# Altium project Urukul.PrjPCB (part 5 of 5)

## Sheet CLK_INPUT.SchDoc: Clock distribution
size 420 x 297 mm; Author: G.K.; CompanyName: WUT; DrawnBy: G.K.; Organization: WUT ISE; Address1: Warsaw Univeristy of Technology; Address2: Nowowiejska 15/19; DocumentNumber: 6; Revision: 1.5.6; SheetNumber: 6; SheetTotal: 7; EDA_Number: ARTIQ; Projet: ARTIQ/SINARA; ModifiedBy: -; CreateDate: XX/XX/XXXX; CheckedDate: -; Title2: and generation; DivGrp: ISE; Designer: G.K.; ModifiedDate: -; ProjectName: ARTIQ/SINARA
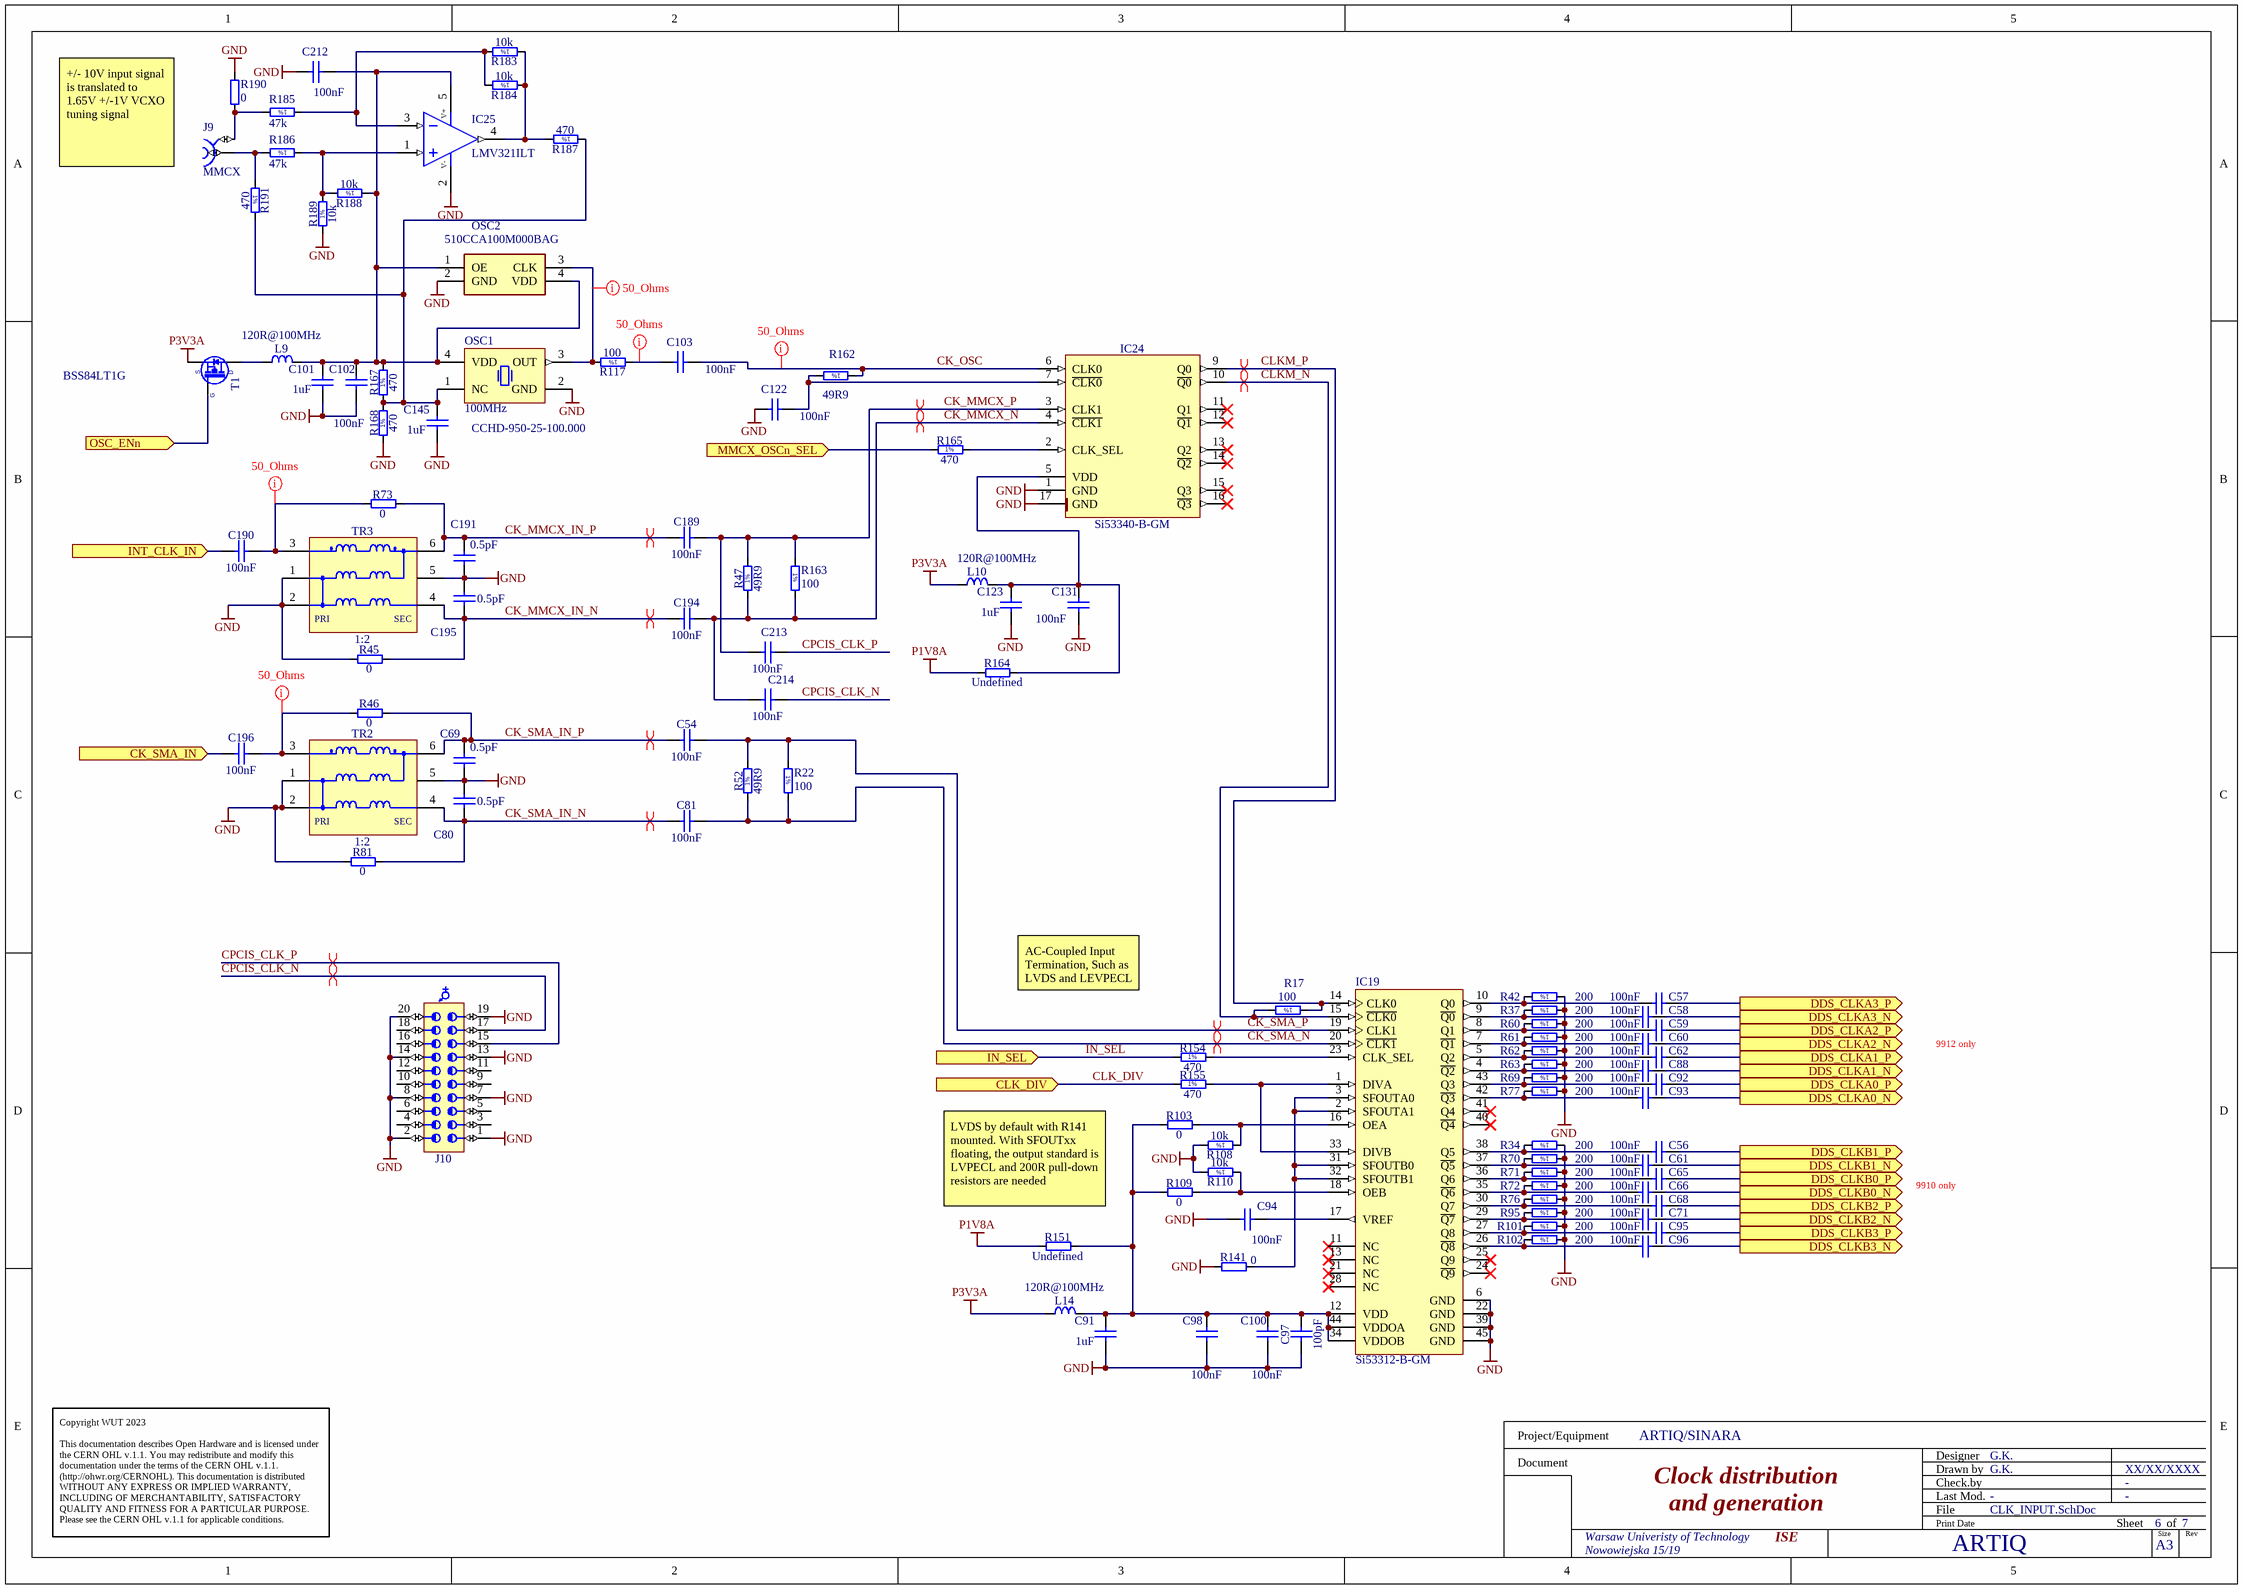
[diagram p6: CLK_INPUT.SchDoc]

### Parts
C54  100nF  [CAPC1005X55N]
C56  100nF  [CAPC1005X55N]
C57  100nF  [CAPC1005X55N]
C58  100nF  [CAPC1005X55N]
C59  100nF  [CAPC1005X55N]
C60  100nF  [CAPC1005X55N]
C61  100nF  [CAPC1005X55N]
C62  100nF  [CAPC1005X55N]
C65  100nF  [CAPC1005X55N]
C66  100nF  [CAPC1005X55N]
C68  100nF  [CAPC1005X55N]
C69  0.5pF  [CAPC1005X50N]
C71  100nF  [CAPC1005X55N]
C80  0.5pF  [CAPC1005X50N]
C81  100nF  [CAPC1005X55N]
C88  100nF  [CAPC1005X55N]
C91  1uF  [CAPC1005X55N]
C92  100nF  [CAPC1005X55N]
C93  100nF  [CAPC1005X55N]
C94  100nF  [CAPC1005X55N]
C95  100nF  [CAPC1005X55N]
C96  100nF  [CAPC1005X55N]
C97  100pF  [CAPC1005X55N]
C98  100nF  [CAPC1005X55N]
C100  100nF  [CAPC1005X55N]
C101  1uF  [CAPC1005X55N]
C102  100nF  [CAPC1005X55N]
C103  100nF  [CAPC1005X55N]
C122  100nF  [CAPC1005X55N]
C123  1uF  [CAPC1005X55N]
C131  100nF  [CAPC1005X55N]
C145  1uF  [CAPC1005X55N]
C189  100nF  [CAPC1005X55N]
C190  100nF  [CAPC1005X55N]
C191  0.5pF  [CAPC1005X50N]
C194  100nF  [CAPC1005X55N]
C195  0.5pF  [CAPC1005X50N]
C196  100nF  [CAPC1005X55N]
C212  100nF  [CAPC1005X55N]
C213  100nF  [CAPC1005X55N]
C214  100nF  [CAPC1005X55N]
IC19  Si53312-B-GM  [SLAB-QFN-44-2800x2800TP_N]
IC24  Si53340-B-GM  [QFN50P300X300X90-17N-S175]
IC25  LMV321ILT  [SOT95P280X145-5N]
J9  MMCX  [SAMTEC_MMCX-J-P-H-ST-TH1]
J10  (no value)  [SAMTEC_LSS-110-01-L-DV-A]
L9  120R@100MHz  [INDC1608X95N]
L10  120R@100MHz  [INDC1608X95N]
L14  120R@100MHz  [INDC1608X95N]
OSC1  100MHz  Manufacturer Part Number: CCHD-950-25-100.000  [OSC_CRYSTEK_CCHD-950]
OSC2  510CCA100M000BAG  [510CBA49M1520BAG]
R17  100  [RESC1005X40N]
R22  100  [RESC1005X40N]
R34  200  [RESC1005X40N]
R37  200  [RESC1005X40N]
R42  200  [RESC1005X40N]
R45  0  [RESC1005X40N]
R46  0  [RESC1005X40N]
R47  49R9  [RESC1005X40N]
R52  49R9  [RESC1005X40N]
R60  200  [RESC1005X40N]
R61  200  [RESC1005X40N]
R62  200  [RESC1005X40N]
R63  200  [RESC1005X40N]
R69  200  [RESC1005X40N]
R70  200  [RESC1005X40N]
R71  200  [RESC1005X40N]
R72  200  [RESC1005X40N]
R73  0  [RESC1005X40N]
R76  200  [RESC1005X40N]
R77  200  [RESC1005X40N]
R81  0  [RESC1005X40N]
R95  200  [RESC1005X40N]
R101  200  [RESC1005X40N]
R102  200  [RESC1005X40N]
R103  0  [RESC1608X55N]
R108  10k  [RESC1005X40N]
R109  0  [RESC1608X55N]
R110  10k  [RESC1005X40N]
R117  100  [RESC1005X40N]
R141  0  [RESC1608X55N]
R151  Undefined  [RESC1608X55N]
R154  470  [RESC1005X40N]
R155  470  [RESC1005X40N]
R162  49R9  [RESC1005X40N]
R163  100  [RESC1005X40N]
R164  Undefined  [RESC1608X55N]
R165  470  [RESC1005X40N]
R167  470  [RESC1005X40N]
R168  470  [RESC1005X40N]
R183  10k  [RESC1005X40N]
R184  10k  [RESC1005X40N]
R185  47k  [RESC1608X55N]
R186  47k  [RESC1608X55N]
R187  470  [RESC1005X40N]
R188  10k  [RESC1005X40N]
R189  10k  [RESC1005X40N]
R190  0  [RESC1005X40N]
R191  470  [RESC1005X40N]
T1  BSS84LT1G  [SOT95P240X110-3N]
TR2  1:2  [XFMR_MINI-CIRCUITS_DB1627]
TR3  1:2  [XFMR_MINI-CIRCUITS_DB1627]

### Ports
CK_SMA_IN (in), CLK_DIV (in), DDS_CLKA0_N (out), DDS_CLKA0_P (out), DDS_CLKA1_N (out), DDS_CLKA1_P (out), DDS_CLKA2_N (out), DDS_CLKA2_P (out), DDS_CLKA3_N (out), DDS_CLKA3_P (out), DDS_CLKB0_N (out), DDS_CLKB0_P (out), DDS_CLKB1_N (out), DDS_CLKB1_P (out), DDS_CLKB2_N (out), DDS_CLKB2_P (out), DDS_CLKB3_N (out), DDS_CLKB3_P (out), IN_SEL (in), INT_CLK_IN (in), MMCX_OSCn_SEL (in), OSC_ENn (in)

### Nets
GND: C69.1 C80.2 C91.1 C94.1 C97.1 C98.1 C100.1 C101.1 C102.1 C122.2 C123.1 C131.1 C145.1 C191.1 C195.2 C212.2 IC19.6(GND) IC19.22(GND) IC19.39(GND) IC19.45(GND) IC24.1(GND) IC24.17(GND) IC25.2(V-) J10.1 J10.2 J10.7 J10.8 J10.13 J10.14 J10.19 J10.20 OSC1.2(GND) OSC2.2(GND) R34.1 R37.1 R42.1 R45.1 R60.1 R61.1 R62.1 R63.1 R69.1 R70.1 R71.1 R72.1 R76.1 R77.1 R81.1 R95.1 R101.1 R102.1 R108.2 R110.2 R141.1 R168.1 R189.1 R190.2 TR2.1(P1) TR2.2(P1) TR2.5(NC) TR3.1(P1) TR3.2(P1) TR3.5(NC)
P1V8A: R151.1 R164.1
P3V3A: L10.2 L14.2 T1.2(S)
CK_MMCX_IN_N: C194.1 C195.1 R45.2 TR3.4(S1)
CK_MMCX_IN_P: C189.1 C191.2 R73.2 TR3.6(S1)
CK_MMCX_N: C194.2 C214.1 IC24.4(~{CLK1}) R47.1 R163.2
CK_MMCX_P: C189.2 C213.1 IC24.3(CLK1) R47.2 R163.1
CK_OSC: C103.1 IC24.6(CLK0) R162.1
CK_SMA_IN: C196.1 ; port CK_SMA_IN
CK_SMA_IN_N: C80.1 C81.1 R81.2 TR2.4(S1)
CK_SMA_IN_P: C54.1 C69.2 R46.2 TR2.6(S1)
CK_SMA_N: C81.2 IC19.20(~{CLK1}) R22.2 R52.1
CK_SMA_P: C54.2 IC19.19(CLK1) R22.1 R52.2
CLK_DIV: R155.1 ; port CLK_DIV
CLKM_N: IC19.15(~{CLK0}) IC24.10(~{Q0}) R17.2
CLKM_P: IC19.14(CLK0) IC24.9(Q0) R17.1
CPCIS_CLK_N: C214.2 J10.17
CPCIS_CLK_P: C213.2 J10.15
DDS_CLK_N: C93.1 ; port DDS_CLKA0_N
DDS_CLK_N: C88.1 ; port DDS_CLKA1_N  [a separate net that carries the same name]
DDS_CLK_N: C60.1 ; port DDS_CLKA2_N  [a separate net that carries the same name]
DDS_CLK_N: C58.1 ; port DDS_CLKA3_N  [a separate net that carries the same name]
DDS_CLK_P: C92.1 ; port DDS_CLKA0_P
DDS_CLK_P: C62.1 ; port DDS_CLKA1_P  [a separate net that carries the same name]
DDS_CLK_P: C59.1 ; port DDS_CLKA2_P  [a separate net that carries the same name]
DDS_CLK_P: C57.1 ; port DDS_CLKA3_P  [a separate net that carries the same name]
DDS_CLKB0_N: C66.1 ; port DDS_CLKB0_N
DDS_CLKB0_P: C65.1 ; port DDS_CLKB0_P
DDS_CLKB1_N: C61.1 ; port DDS_CLKB1_N
DDS_CLKB1_P: C56.1 ; port DDS_CLKB1_P
DDS_CLKB2_N: C71.1 ; port DDS_CLKB2_N
DDS_CLKB2_P: C68.1 ; port DDS_CLKB2_P
DDS_CLKB3_N: C96.1 ; port DDS_CLKB3_N
DDS_CLKB3_P: C95.1 ; port DDS_CLKB3_P
IN_SEL: R154.1 ; port IN_SEL
INT_CLK_IN: C190.1 ; port INT_CLK_IN
MMCX_OSCn_SEL: R165.1 ; port MMCX_OSCn_SEL
OSC_ENn: T1.1(G) ; port OSC_ENn
NetC56_2: C56.2 IC19.38(Q5) R34.2
NetC57_2: C57.2 IC19.10(Q0) R42.2
NetC58_2: C58.2 IC19.9(~{Q0}) R37.2
NetC59_2: C59.2 IC19.8(Q1) R60.2
NetC60_2: C60.2 IC19.7(~{Q1}) R61.2
NetC61_2: C61.2 IC19.37(~{Q5}) R70.2
NetC62_2: C62.2 IC19.5(Q2) R62.2
NetC65_2: C65.2 IC19.36(Q6) R71.2
NetC66_2: C66.2 IC19.35(~{Q6}) R72.2
NetC68_2: C68.2 IC19.30(Q7) R76.2
NetC71_2: C71.2 IC19.29(~{Q7}) R95.2
NetC88_2: C88.2 IC19.4(~{Q2}) R63.2
NetC91_2: C91.2 C97.2 C98.2 C100.2 IC19.12(VDD) IC19.34(VDDOB) IC19.44(VDDOA) L14.1 R103.1 R109.1 R151.2
NetC92_2: C92.2 IC19.43(Q3) R69.2
NetC93_2: C93.2 IC19.42(~{Q3}) R77.2
NetC94_2: C94.2 IC19.17(VREF)
NetC95_2: C95.2 IC19.27(Q8) R101.2
NetC96_2: C96.2 IC19.26(~{Q8}) R102.2
NetC101_2: C101.2 C102.2 C212.1 IC25.5(V+) L9.1 OSC1.4(VDD) OSC2.1(OE) OSC2.4(VDD) R167.2 R188.1
NetC103_2: C103.2 R117.1
NetC122_1: C122.1 IC24.7(~{CLK0}) R162.2
NetC123_2: C123.2 C131.2 IC24.5(VDD) L10.1 R164.2
NetC145_2: C145.2 OSC1.1(NC) R167.1 R168.2 R187.1 R191.2
NetC190_2: C190.2 R73.1 TR3.3(P1)
NetC196_2: C196.2 R46.1 TR2.3(P1)
NetIC19_1: IC19.1(DIVA) IC19.33(DIVB) R155.2
NetIC19_2: IC19.2(SFOUTA1) IC19.3(SFOUTA0) IC19.31(SFOUTB0) IC19.32(SFOUTB1) R141.2
NetIC19_16: IC19.16(OEA) R103.2 R108.1
NetIC19_18: IC19.18(OEB) R109.2 R110.1
NetIC19_23: IC19.23(CLK_SEL) R154.2
NetIC24_2: IC24.2(CLK_SEL) R165.2
NetIC25_1: IC25.1(IN+) R186.1 R188.2 R189.2
NetIC25_3: IC25.3(IN-) R183.2 R184.2 R185.1
NetIC25_4: IC25.4(OUT) R183.1 R184.1 R187.2
NetJ9_1: J9.1 R186.2 R191.1
NetJ9_2: J9.2 R185.2 R190.1
NetL9_2: L9.2 T1.3(D)
NetOSC1_3: OSC1.3(OUT) OSC2.3(CLK) R117.2

Not connected (* = marked no-connect by the designer): IC19 11(NC)* 13(NC)* 21(NC)* 24(~{Q9})* 25(Q9)* 28(NC)* 40(~{Q4})* 41(Q4)*; IC24 11(Q1)* 12(~{Q1})* 13(Q2)* 14(~{Q2})* 15(Q3)* 16(~{Q3})*; J10 3 4 5 6 9 10 11 12 16 18

### Layout directives
differential pair: CK_MMCX_IN_N, CK_MMCX_IN_P, CK_MMCX_N, CK_MMCX_P, CK_SMA_IN_N, CK_SMA_IN_P, CK_SMA_N, CK_SMA_P, CLKM_N, CLKM_P, CPCIS_CLK_N, CPCIS_CLK_P
net class 50_Ohms: CK_OSC, NetC103_2, NetC190_2, NetC196_2, NetOSC1_3

### Notes on the sheet
- (near J9) +/- 10V input signal is translated to 1.65V +/-1V VCXO tuning signal
- AC-Coupled Input Termination, Such as LVDS and LEVPECL
- 9912 only
- LVDS by default with R141 mounted. With SFOUTxx floating, the output standard is LVPECL and 200R pull-down resistors are needed
- 9910 only
- Copyright WUT 2023
  This documentation describes Open Hardware and is licensed under the CERN OHL v.1.1. You may redistribute and modify this documentation under the terms of the CERN OHL v.1.1. (http://ohwr.org/CERNOHL). This documentation is distributed WITHOUT ANY EXPRESS OR IMPLIED WARRANTY, INCLUDING OF MERCHANTABILITY, SATISFACTORY QUALITY AND FITNESS FOR A PARTICULAR PURPOSE. Please see the CERN OHL v.1.1 for applicable conditions.
- Project/Equipment
- Document
- Designer
- Drawn by
- Check.by
- File
- Last Mod.
- Print Date
- Sheet
- Size
- A3
- of
- Rev
- (in symbol R0402_10K_1%_0.0625W_100PPM) 1%
- (in symbol R0402_49R9_1%_0.0625W_100PPM) 1%
- (in symbol R0402_100R_1%_0.0625W_100PPM) 1%
- (in symbol R0402_200R_1%_0.0625W_100PPM) 1%
- (in symbol R0402_470R_1%_0.0625W_100PPM) 1%
- (in symbol R0603_47K_1%_0.1W_100PPM) 1%
- (in symbol XFMR_MINI-CIRCUITS_TCM2-43X+) PRI; SEC

### Library data of the parts
C54 C56-C62 C65 C66 C68 C71 C81 C88 C92-C96 C98 C100 C102 C103 C122 C131 C189 C190 C194 C196 C212-C214 = CC0402_100NF_16V_10%_X5R: Non-polarised capacitor; Part Description: SMD Multilayer Chip Ceramic Capacitor; Manufacturer: GENERIC; Manufacturer1 Part Number: GRM155R61C104KA88D; Voltage: 16V; TC: X5R; Tolerance: ±10%; Part Number: CC0402_100NF_16V_10%_X5R; Component Kind: Standard; Component Type: Standard; Pin Count: 2; Value: 100nF; Status: None; Manufacturer Part Number: CC0402_100NF_16V_10%_X5R; Case: 0402; Mounted: Yes; Socket: No; SMD: Yes; Sense: No; Manufacturer1 Example: MURATA; Manufacturer1 ComponentHeight: 0.55mm; HelpURL: \\cern.ch\dfs\Applications\Altium\Datasheets\CC0402_X5R_MURATA_GRM.pdf; Author: CERN DEM JLC; CreateDate: 10.12.2013; LatestRevisionDate: 10.12.2013
C69 C80 C191 C195 = CC0402_0.5PF_25V_0.05PF_AVX_04023J0R5ABSTR: Non-polarised capacitor; Part Description: Thin-Film Chip Capacitors for RF Signal and Power Applications, Accu-P Series; Manufacturer: AVX; Voltage: 25V; Tolerance: ±0.05pF; Part Number: CC0402_0.5PF_25V_0.05PF_AVX_04023J0R5ABSTR; Component Kind: Standard; Component Type: Standard; Pin Count: 2; Value: 0.5pF; Status: None; Manufacturer Part Number: 04023J0R5ABSTR; Case: 0402; Mounted: Yes; Socket: No; SMD: Yes; Sense: No; ComponentHeight: 0.5mm; HelpURL: \\cern.ch\dfs\Applications\Altium\Datasheets\CC0402_AVX_ACCU-P.pdf; Author: CERN DEM JLC; CreateDate: 2017-02-22; LatestRevisionDate: 2017-02-22
C91 C101 C123 C145 = CC0402_1UF_16V_10%_X5R: Non-polarised capacitor; Part Description: SMD Multilayer Chip Ceramic Capacitor; Manufacturer: GENERIC; Manufacturer1 Part Number: C1005X5R1C105KT; Voltage: 16V; TC: X5R; Tolerance: ±10%; Part Number: CC0402_1UF_16V_10%_X5R; Component Kind: Standard; Component Type: Standard; Pin Count: 2; Value: 1uF; Status: Preferred; Manufacturer Part Number: CC0402_1UF_16V_10%_X5R; Case: 0402; Mounted: Yes; Socket: No; SMD: Yes; Sense: No; Manufacturer1 Example: TDK; Manufacturer1 ComponentHeight: 0.55mm; HelpURL: \\cern.ch\dfs\Applications\Altium\Datasheets\CC0402_X5R_TDK_C.pdf; Author: CERN DEM JLC; CreateDate: 2012-10-25; LatestRevisionDate: 2012-10-25
C97 = CC0402_100PF_50V_5%_C0G: Non-polarised capacitor; Part Description: SMD Multilayer Chip Ceramic Capacitor; Manufacturer: GENERIC; Manufacturer1 Part Number: C0402C101J5GACTU; Voltage: 50V; TC: C0G/NP0; Tolerance: ±5%; Part Number: CC0402_100PF_50V_5%_C0G; Component Kind: Standard; Component Type: Standard; Pin Count: 2; Value: 100pF; Status: Preferred; Manufacturer Part Number: CC0402_100PF_50V_5%_C0G; Case: 0402; Mounted: Yes; Socket: No; SMD: Yes; Sense: No; Manufacturer1 Example: KEMET; Manufacturer1 ComponentHeight: 0.55mm; HelpURL: \\cern.ch\dfs\Applications\Altium\Datasheets\CC0805_C0G_KEMET_(Commercial Grade).pdf; Author: CERN DEM JLC; CreateDate: 03.12.2007; LatestRevisionDate: 22.04.2015
IC19 = CMP-0510-00356-1: 1:10 Low Jitter Universal Buffer / Level Translator with 2:1 Input Mux, 1 to 1250 MHz, -40 to 85 degC, 44-pin QFN; Manufacturer: Silicon Labs; Output Format: LVPECL; LVDS; CML; HCSL; LVCMOS; Sub-Family: Clock Buffers; PartNumber: Si53312-B-GM; ComponentLink2URL: http://www.silabs.com/Support%20Documents/TechnicalDocs/Si53312.pdf; ComponentLink1URL: http://www.silabs.com/; ComponentLink3URL: http://www.silabs.com/Support%20Documents/TechnicalDocs/Si53302.pdf; ComponentLink1Description: Manufacturer URL; Code_IPC: J-STD-020; Frequency (MHz): 1 to 1250; ComponentLink2Description: Datasheet; ComponentLink3Description: Package Specification; Code_JEDEC: MO-220; Mounting Technology: Surface Mount; PackageDescription: 44-Pin Quad-Flat No-Leads Package, Body 7 x 7 mm, Pitch 0.5 mm; DatasheetVersion: Rev. 0.4; PackageReference: QFN-44
IC24 = Si53340-B-GM: Low-Jitter LVDS Fanout Clock Buffers, 10-Output,  Any-Input, Any-Frequency up to 1250MHz; Manufacturer: SILICON LABS; PressFit: No; Bonding: No; Part Number: Si53340-B-GM; Component Kind: Standard; Component Type: Standard; Device: Si53340-B-GM; PackageDescription: QFN, 0.50mm Pitch, Square; 16 Pin, 3.00mm L X 3.00mm W X 0.90mm H Body (w/thermal tab 1.75mm x 1.75mm), IPC Medium Density; Part Description: Low-Jitter LVDS Fanout Clock Buffers, 10-Output,  Any-Input, Any-Frequency up to 1250MHz; Manufacturer Part Number: Si53340-B-GM; Pin Count: 17; Case: QFN16; Mounted: Yes; Socket: No; SMD: Yes; Sense: No; ComponentHeight: 0.9mm; HelpURL: \\cern.ch\dfs\Applications\Altium\Datasheets\Si53340-B-GM.pdf; Author: CERN DEM MR; CreateDate: 04.09.2017; LatestRevisionDate: 04.09.2017
IC25 = LMV321ILT: Operational Amplifier; Part Description: Low Cost, Low Power, Input/Output Rail-To-Rail Operational Amplifiers; Manufacturer: ST MICROELECTRONICS; PressFit: No; Bonding: No; Part Number: LMV321ILT; Component Kind: Standard; Component Type: Standard; Device: LMV321ILT; PackageDescription: SOT, 0.95mm pitch; 5 pin, 1.60mm W X 2.90mm L X 1.45mm H body, IPC Medium Density; Manufacturer Part Number: LMV321ILT; Pin Count: 5; Case: SOT23-5; Mounted: Yes; Socket: No; SMD: Yes; Sense: No; ComponentHeight: 1.45mm; Author: CERN DEM MR; HelpURL: \\cern.ch\dfs\Applications\Altium\Datasheets\LMV321ILT.pdf; CreateDate: 02/10/2017; LatestRevisionDate: 02/10/2017
J9 = SAMTEC_MMCX-J-P-H-ST-TH1: Part Description: Straight Through-hole 50 Ohm Micro Mini RF Jack, MMCX Series; Manufacturer: SAMTEC; PressFit: No; Part Number: SAMTEC_MMCX-J-P-H-ST-TH1; Component Kind: Standard; Component Type: Standard; Pin Count: 2; Mounted: Yes; Socket: No; Sense: No; SMD: No; Status: None; Manufacturer Part Number: MMCX-J-P-H-ST-TH1; ComponentHeight: 4.35mm; HelpURL: \\cern.ch\dfs\Applications\Altium\Datasheets\SAMTEC_MMCX-J-P-H-ST-TH1.pdf; Author: CERN DEM JLC; CreateDate: 05.12.2012; LatestRevisionDate: 05.12.2012
J10 = SAMTEC_LSS-110-01-L-DV-A: Connector 20 Hermaphroditic; Part Description: 20 Contacts, Pitch 0.635mm, Razor Beam LSS Vertical High Speed Hermaphroditic Strip (Lead Style 4.5mm); Manufacturer: SAMTEC; PressFit: No; Part Number: SAMTEC_LSS-110-01-L-DV-A; Component Kind: Standard; Component Type: Standard; Pin Count: 20; Mounted: Yes; Socket: No; Sense: No; SMD: Yes; Status: None; Manufacturer Part Number: LSS-110-01-L-DV-A; ComponentHeight: 4.57mm; HelpURL: \\cern.ch\dfs\Applications\Altium\Datasheets\SAMTEC_LSS-110-01-L-DV-A.pdf; Author: CERN DEM MR; CreateDate: 07.03.2016; LatestRevisionDate: 07.03.2016
L9 L10 L14 = IND0603_MURATA_BLM18PG121SN1D: Inductor; Part Description: SMD EMIFIL Chip Ferrite Bead; Manufacturer: MURATA; Power: 2A; Resistance: 0.05R; Part Number: IND0603_MURATA_BLM18PG121SN1D; Component Kind: Standard; Component Type: Standard; Pin Count: 2; Value: 120R@100MHz; Status: None; Manufacturer Part Number: BLM18PG121SN1D; Case: 0603; Mounted: Yes; Socket: No; SMD: Yes; Sense: No; ComponentHeight: 0.95mm; HelpURL: \\cern.ch\dfs\Applications\Altium\Datasheets\IND0603_MURATA_BLM18P.pdf; Author: CERN DEM BC; CreateDate: 2015-07-27; LatestRevisionDate: 2015-07-27
OSC1 = OSC_CCHD-950: 100MHz low noise oscillator; Part Number: OSC_100MHZ_CRYSTEK_CCHD-950-25-100.000; Part Description: 3.3V, ±25ppm, 0..70°C, CMOS Surface Mount Ultra-Low Noise Oscillator (CCHD-950 Series); Manufacturer: CRYSTEK CRYSTAL; PressFit: No; Bonding: No; Component Kind: Standard; Component Type: Standard; PackageDescription: Oscillator, 5.08mm Pitch; 4 Pin, 14.2mm L X 9.14mm W X 5.3mm H, CCHD-950 Serie; Value: 100MHz; Pin Count: 4; Mounted: Yes; Socket: No; SMD: Yes; Sense: No; ComponentHeight: 5.3mm; HelpURL: \\cern.ch\dfs\Applications\Altium\Datasheets\OSC_CRYSTEK_CVHD-950.pdf; Author: GK; CreateDate: 04.11.2016; LatestRevisionDate: 04.11.2016
OSC2 = 510CCA100M000BAG: Crystal or Oscillator; Manufacturer_Name: Silicon Labs; Datasheet Link: https://www.silabs.com/documents/public/data-sheets/si510-11.pdf; Height: 1mm; Manufacturer_Part_Number: 510CCA100M000BAG; Mouser Part Number: 634-510CCA100M000BAG; Mouser Price/Stock: https://www.mouser.com/Search/Refine.aspx?Keyword=634-510CCA100M000BAG
R17 R22 R117 R163 = R0402_100R_1%_0.0625W_100PPM: Resistor - 1%; Part Description: General Purpose Thick Film Chip Resistor; Manufacturer: GENERIC; Manufacturer1 Part Number: 232270671001L; TC: ±100ppm/°C; PressFit: No; Part Number: R0402_100R_1%_0.0625W_100PPM; Component Kind: Standard; Component Type: Standard; Pin Count: 2; Value: 100; Status: Not Recommended; Power: 0.0625W; Tolerance: ±1%; Manufacturer Part Number: R0402_100R_1%_0.0625W_100PPM; Case: 0402; Mounted: Yes; Sense: No; Socket: No; SMD: Yes; Manufacturer1 Example: YAGEO PHYCOMP; Manufacturer1 ComponentHeight: 0.4mm; HelpURL: \\cern.ch\dfs\Applications\Altium\Datasheets\R0402_Phycomp_RC0402.pdf; Author: CERN DEM JLC; CreateDate: 03.12.2007; LatestRevisionDate: 17.10.2012
R34 R37 R42 R60-R63 R69-R72 R76 R77 R95 R101 R102 = R0402_200R_1%_0.0625W_100PPM: Resistor - 1%; Part Description: General Purpose Thick Film Chip Resistor; Manufacturer: GENERIC; Manufacturer1 Part Number: 232270672001L; TC: ±100ppm/°C; PressFit: No; Part Number: R0402_200R_1%_0.0625W_100PPM; Component Kind: Standard; Component Type: Standard; Pin Count: 2; Value: 200; Status: Not Recommended; Power: 0.0625W; Tolerance: ±1%; Manufacturer Part Number: R0402_200R_1%_0.0625W_100PPM; Case: 0402; Mounted: Yes; Sense: No; Socket: No; SMD: Yes; Manufacturer1 Example: YAGEO PHYCOMP; Manufacturer1 ComponentHeight: 0.4mm; HelpURL: \\cern.ch\dfs\Applications\Altium\Datasheets\R0402_Phycomp_RC0402.pdf; Author: CERN DEM JLC; CreateDate: 03.12.2007; LatestRevisionDate: 17.10.2012
R45 R46 R73 R81 R190 = R0402_0R_JUMPER: Resistor; Part Description: 1A (0.05R Max DC Resistance) Zero Ohm Jumper; Manufacturer: GENERIC; Manufacturer1 Part Number: 232270591001L; PressFit: No; Part Number: R0402_0R_JUMPER; Component Kind: Standard; Component Type: Standard; Pin Count: 2; Value: 0; Status: Not Recommended; Manufacturer Part Number: R0402_0R_JUMPER; Case: 0402; Mounted: Yes; Sense: No; Socket: No; SMD: Yes; Manufacturer1 Example: YAGEO PHYCOMP; Manufacturer1 ComponentHeight: 0.4mm; HelpURL: \\cern.ch\dfs\Applications\Altium\Datasheets\R0402_Phycomp_RC0402.pdf; Author: CERN DEM JLC; CreateDate: 03.12.2007; LatestRevisionDate: 17.10.2012
R47 R52 R162 = R0402_49R9_1%_0.0625W_100PPM: Resistor - 1%; Part Description: General Purpose Thick Film Chip Resistor; Manufacturer: GENERIC; Manufacturer1 Part Number: 232270674999L or RC0402FR-0749R9L; TC: ±100ppm/°C; PressFit: No; Part Number: R0402_49R9_1%_0.0625W_100PPM; Component Kind: Standard; Component Type: Standard; Pin Count: 2; Value: 49R9; Status: Not Recommended; Power: 0.0625W; Tolerance: ±1%; Manufacturer Part Number: R0402_49R9_1%_0.0625W_100PPM; Case: 0402; Mounted: Yes; Sense: No; Socket: No; SMD: Yes; Manufacturer1 Example: YAGEO PHYCOMP; Manufacturer1 ComponentHeight: 0.4mm; HelpURL: \\cern.ch\dfs\Applications\Altium\Datasheets\R0402_Phycomp_RC0402.pdf; Author: CERN DEM JLC; CreateDate: 24.10.2012; LatestRevisionDate: 24.10.2012
R103 R109 R141 = R0603_0R_JUMPER: Resistor; Part Description: 1A (0.05R Max DC Resistance) Zero Ohm Jumper; Manufacturer: GENERIC; Manufacturer1 Part Number: NRC06Z0; Part Number: R0603_0R_JUMPER; Component Kind: Standard; Component Type: Standard; Pin Count: 2; Value: 0; Status: Preferred; Manufacturer Part Number: R0603_0R_JUMPER; Case: 0603; Mounted: Yes; Sense: No; Socket: No; SMD: Yes; Manufacturer1 Example: NIC COMPONENT; Manufacturer1 ComponentHeight: 0.55mm; HelpURL: \\cern.ch\dfs\Applications\Altium\Datasheets\R0603_NIC_NRC.pdf; Author: CERN DEM JLC; CreateDate: 03.12.2007; LatestRevisionDate: 13.03.2008
R108 R110 = R0402_10K_1%_0.0625W_100PPM: Resistor - 1%; Part Description: General Purpose Thick Film Chip Resistor; Manufacturer: GENERIC; Manufacturer1 Part Number: 232270671003L; TC: ±100ppm/°C; Part Number: R0402_10K_1%_0.0625W_100PPM; Component Kind: Standard; Component Type: Standard; Pin Count: 2; Value: 10k; Status: Not recommended; Power: 0.0625W; Tolerance: ±1%; Manufacturer Part Number: R0402_10K_1%_0.0625W_100PPM; Case: 0402; Mounted: Yes; Sense: No; Socket: No; SMD: Yes; Manufacturer1 Example: YAGEO PHYCOMP; Manufacturer1 ComponentHeight: 0.4mm; HelpURL: \\cern.ch\dfs\Applications\Altium\Datasheets\R0402_Phycomp_RC0402.pdf; Author: CERN DEM JLC; CreateDate: 03.12.2007; LatestRevisionDate: 17.10.2012
R151 R164 = R0603_NO-VALUE: Resistor; Part Description: Reserved Footprint For a 0603 (1608) Chip Resistor; PressFit: No; Mounted: No; Part Number: R0603_NO-VALUE; Component Kind: Standard; Component Type: Standard; Pin Count: 2; Value: Undefined; Status: None; Manufacturer: Undefined; Manufacturer Part Number: R0603_NO-VALUE; Case: 0603; Sense: No; Socket: No; SMD: Yes; Manufacturer1 Example: Undefined; Manufacturer1 Part Number: Undefined; Manufacturer1 ComponentHeight: Undefined; HelpURL: Undefined; Author: CERN DEM JLC; CreateDate: 03.12.2007; LatestRevisionDate: 13.03.2008
R154 R155 R165 R167 R168 R187 R191 = R0402_470R_1%_0.0625W_100PPM: Resistor - 1%; Part Description: General Purpose Thick Film Chip Resistor; Manufacturer: GENERIC; Manufacturer1 Part Number: 232270674701L; TC: ±100ppm/°C; PressFit: No; Part Number: R0402_470R_1%_0.0625W_100PPM; Component Kind: Standard; Component Type: Standard; Pin Count: 2; Value: 470; Status: Not Recommended; Power: 0.0625W; Tolerance: ±1%; Manufacturer Part Number: R0402_470R_1%_0.0625W_100PPM; Case: 0402; Mounted: Yes; Sense: No; Socket: No; SMD: Yes; Manufacturer1 Example: YAGEO PHYCOMP; Manufacturer1 ComponentHeight: 0.4mm; HelpURL: \\cern.ch\dfs\Applications\Altium\Datasheets\R0402_Phycomp_RC0402.pdf; Author: CERN DEM JLC; CreateDate: 03.12.2007; LatestRevisionDate: 17.10.2012
R183 R184 R188 R189 = R0402_10K_1%_0.0625W_100PPM: Resistor - 1%; Part Description: General Purpose Thick Film Chip Resistor; Manufacturer: GENERIC; Manufacturer1 Part Number: 232270671003L; TC: ±100ppm/°C; PressFit: No; Part Number: R0402_10K_1%_0.0625W_100PPM; Component Kind: Standard; Component Type: Standard; Pin Count: 2; Value: 10k; Status: Not Recommended; Power: 0.0625W; Tolerance: ±1%; Manufacturer Part Number: R0402_10K_1%_0.0625W_100PPM; Case: 0402; Mounted: Yes; Sense: No; Socket: No; SMD: Yes; Manufacturer1 Example: YAGEO PHYCOMP; Manufacturer1 ComponentHeight: 0.4mm; HelpURL: \\cern.ch\dfs\Applications\Altium\Datasheets\R0402_Phycomp_RC0402.pdf; Author: CERN DEM JLC; CreateDate: 03.12.2007; LatestRevisionDate: 17.10.2012
R185 R186 = R0603_47K_1%_0.1W_100PPM: Resistor - 1%; Part Description: General Purpose Thick Film Chip Resistor; Manufacturer: GENERIC; Manufacturer1 Part Number: NRC06F4702TRF; Power: 0.1W; TC: ±100ppm/°C; Part Number: R0603_47K_1%_0.1W_100PPM; Component Kind: Standard; Component Type: Standard; Pin Count: 2; Value: 47k; Status: Preferred; Tolerance: ±1%; Manufacturer Part Number: R0603_47K_1%_0.1W_100PPM; Case: 0603; Mounted: Yes; Sense: No; Socket: No; SMD: Yes; Manufacturer1 Example: NIC COMPONENT; Manufacturer1 ComponentHeight: 0.55mm; HelpURL: \\cern.ch\dfs\Applications\Altium\Datasheets\R0603_NIC_NRC.pdf; Author: CERN DEM JLC; CreateDate: 03.12.2007; LatestRevisionDate: 13.03.2008
T1 = BSS84LT1G: P-CHANNEL MOSFET WITH DIODE; Part Description: 50V 130mA Single P-Channel Power MOSFET; Manufacturer: ON SEMICONDUCTOR; PressFit: No; Bonding: No; Part Number: BSS84LT1G; Component Kind: Standard; Component Type: Standard; Device: BSS84LT1G; PackageDescription: SOT23 3-Leads, Pitch 0.95mm - Body 1.4x3mm, IPC Medium Density; Manufacturer Part Number: BSS84LT1G; Pin Count: 3; Case: SOT23-3; Mounted: Yes; Socket: No; SMD: Yes; Sense: No; ComponentHeight: 1.1mm; HelpURL: \\cern.ch\dfs\Applications\Altium\Datasheets\BSS84LT1G.pdf; Author: CERN DEM JLC; CreateDate: 29.03.2012; LatestRevisionDate: 29.03.2012
TR2 TR3 = XFMR_MINI-CIRCUITS_TCM2-43X+: 50 OHMS 10 to 4000 MHz RF Transformer; Power: 0.4W; Part Number: XFMR_MINI-CIRCUITS_TCM2-43X+; Component Kind: Standard; Component Type: Standard; Pin Count: 6; Value: 1:2; Status: None; Part Description: 50 Ohms 10 to 4000MHz RF Transformer; Manufacturer: MINI-CIRCUITS; Manufacturer Part Number: TCM2-43X+; Mounted: Yes; Socket: No; Sense: No; SMD: Yes; ComponentHeight: 4.06mm; HelpURL: \\cern.ch\dfs\Applications\Altium\Datasheets\XFMR_MINI-CIRCUITS_TCM2-43X+.pdf; Author: CERN DEM BC; CreateDate: 2016-02-12; LatestRevisionDate: 2016-02-12

## Nets that join several sheets
GND: Urukul (107 pins), U_DDS_OUT_channel0 (60 pins), U_DDS_OUT_channel1 (60 pins), U_DDS_OUT_channel2 (60 pins), U_DDS_OUT_channel3 (60 pins), U_LVDS_IFCA (41 pins), Supply_DDS (80 pins), U_DDS_channel0 (112 pins), U_DDS_channel1 (112 pins), U_DDS_channel2 (112 pins), U_DDS_channel3 (112 pins), U_LVDS_IFCB (41 pins), CTRL_LOGIC (53 pins), CLK_INPUT (63 pins)
P1V8A: Urukul (R150.1), Supply_DDS (7 pins), U_DDS_channel0 (6 pins), U_DDS_channel1 (6 pins), U_DDS_channel2 (6 pins), U_DDS_channel3 (6 pins), CLK_INPUT (R151.1 R164.1)
P3V3: Urukul (L8.2 L13.2), U_LVDS_IFCA (26 pins), Supply_DDS (8 pins), U_LVDS_IFCB (26 pins), CTRL_LOGIC (43 pins)
P3V3_MP: U_LVDS_IFCA (5 pins), Supply_DDS (8 pins), U_LVDS_IFCB (5 pins)
P3V3A: Supply_DDS (7 pins), U_DDS_channel0 (L15A.2 L18A.2), U_DDS_channel1 (L15B.2 L18B.2), U_DDS_channel2 (L15C.2 L18C.2), U_DDS_channel3 (L15D.2 L18D.2), CLK_INPUT (L10.2 L14.2 T1.2)
P5V0A: U_DDS_OUT_channel0 (L6A.2 L7A.1), U_DDS_OUT_channel1 (L6B.2 L7B.1), U_DDS_OUT_channel2 (L6C.2 L7C.1), U_DDS_OUT_channel3 (L6D.2 L7D.1), Supply_DDS (16 pins)
P7V0A: U_DDS_OUT_channel0 (C12A.2 C27A.2 R137A.1), U_DDS_OUT_channel1 (C12B.2 C27B.2 R137B.1), U_DDS_OUT_channel2 (C12C.2 C27C.2 R137C.1), U_DDS_OUT_channel3 (C12D.2 C27D.2 R137D.1), Supply_DDS (7 pins)
P12V0: U_LVDS_IFCA (J1A.28 J1A.29), Supply_DDS (17 pins), U_LVDS_IFCB (J1B.28 J1B.29)
ATT_CLK: U_DDS_OUT_channel0 (IC3A.21), U_DDS_OUT_channel1 (IC3B.21), U_DDS_OUT_channel2 (IC3C.21), U_DDS_OUT_channel3 (IC3D.21), CTRL_LOGIC (IC10.E9)
ATT_LE0: U_DDS_OUT_channel0 (IC3A.22), CTRL_LOGIC (IC10.E10)
ATT_LE1: U_DDS_OUT_channel1 (IC3B.22), CTRL_LOGIC (IC10.P8)
ATT_LE2: U_DDS_OUT_channel2 (IC3C.22), CTRL_LOGIC (IC10.C8)
ATT_LE3: U_DDS_OUT_channel3 (IC3D.22), CTRL_LOGIC (IC10.K4)
ATT_RSTn: U_DDS_OUT_channel0 (IC3A.20), U_DDS_OUT_channel1 (IC3B.20), U_DDS_OUT_channel2 (IC3C.20), U_DDS_OUT_channel3 (IC3D.20), CTRL_LOGIC (IC10.N9)
ATT_S_IN0: U_DDS_OUT_channel0 (IC3A.24), CTRL_LOGIC (IC10.B7)
ATT_S_IN1: U_DDS_OUT_channel1 (IC3B.24), CTRL_LOGIC (IC10.D8)
ATT_S_IN2: U_DDS_OUT_channel2 (IC3C.24), CTRL_LOGIC (IC10.D7)
ATT_S_IN3: U_DDS_OUT_channel3 (IC3D.24), CTRL_LOGIC (IC10.L5)
ATT_S_OUT: Urukul (R147.2), U_DDS_OUT_channel3 (IC3D.19)
ATT_S_OUT: Urukul (R170.2), U_DDS_OUT_channel2 (IC3C.19)
ATT_S_OUT: Urukul (R169.2), U_DDS_OUT_channel1 (IC3B.19)
ATT_S_OUT: Urukul (R100.2), U_DDS_OUT_channel0 (IC3A.19)
ATT_S_OUT0: Urukul (R100.1), CTRL_LOGIC (IC10.C10)
ATT_S_OUT1: Urukul (R169.1), CTRL_LOGIC (IC10.C9)
ATT_S_OUT2: Urukul (R170.1), CTRL_LOGIC (IC10.E8)
ATT_S_OUT3: Urukul (R147.1), CTRL_LOGIC (IC10.R9)
CK_SMA_IN: Urukul (J2.1), CLK_INPUT (C196.1)
CLK_DIV: CTRL_LOGIC (IC10.E5), CLK_INPUT (R155.1)
CSN: U_DDS_channel0 (IC2A.70 IC13A.61), CTRL_LOGIC (IC10.B3)
CSN: U_DDS_channel1 (IC2B.70 IC13B.61), CTRL_LOGIC (IC10.J4)
CSN: U_DDS_channel2 (IC2C.70 IC13C.61), CTRL_LOGIC (IC10.H1)
CSN: U_DDS_channel3 (IC2D.70 IC13D.61), CTRL_LOGIC (IC10.G4)
DAC_OUT_N: U_DDS_OUT_channel0 (R8A.1 R38A.1 TR1A.4 TR8A.3), U_DDS_channel0 (R78A.2 R91A.2)
DAC_OUT_N: U_DDS_OUT_channel1 (R8B.1 R38B.1 TR1B.4 TR8B.3), U_DDS_channel1 (R78B.2 R91B.2)
DAC_OUT_N: U_DDS_OUT_channel2 (R8C.1 R38C.1 TR1C.4 TR8C.3), U_DDS_channel2 (R78C.2 R91C.2)
DAC_OUT_N: U_DDS_OUT_channel3 (R8D.1 R38D.1 TR1D.4 TR8D.3), U_DDS_channel3 (R78D.2 R91D.2)
DAC_OUT_P: U_DDS_OUT_channel0 (R8A.2 R54A.1 TR1A.6 TR8A.1), U_DDS_channel0 (R56A.2 R79A.2)
DAC_OUT_P: U_DDS_OUT_channel1 (R8B.2 R54B.1 TR1B.6 TR8B.1), U_DDS_channel1 (R56B.2 R79B.2)
DAC_OUT_P: U_DDS_OUT_channel2 (R8C.2 R54C.1 TR1C.6 TR8C.1), U_DDS_channel2 (R56C.2 R79C.2)
DAC_OUT_P: U_DDS_OUT_channel3 (R8D.2 R54D.1 TR1D.6 TR8D.1), U_DDS_channel3 (R56D.2 R79D.2)
DDS0_SYNC_IN_N: Urukul (IC9.4), U_DDS_channel0 (IC2A.8)
DDS0_SYNC_IN_P: Urukul (IC9.5), U_DDS_channel0 (IC2A.7)
DDS0_SYNC_OUT_N: Urukul (IC9.15 R68.1), U_DDS_channel0 (IC2A.10)
DDS0_SYNC_OUT_P: Urukul (IC9.14 R68.2), U_DDS_channel0 (IC2A.9)
DDS1_SYNC_IN_N: Urukul (IC9.31), U_DDS_channel1 (IC2B.8)
DDS1_SYNC_IN_P: Urukul (IC9.32), U_DDS_channel1 (IC2B.7)
DDS2_SYNC_IN_N: Urukul (IC9.25), U_DDS_channel2 (IC2C.8)
DDS2_SYNC_IN_P: Urukul (IC9.26), U_DDS_channel2 (IC2C.7)
DDS3_SYNC_IN_N: Urukul (IC9.27), U_DDS_channel3 (IC2D.8)
DDS3_SYNC_IN_P: Urukul (IC9.28), U_DDS_channel3 (IC2D.7)
DDS_CLK_N: U_DDS_channel0 (IC13A.28 R12A.2), CLK_INPUT (C93.1)
DDS_CLK_N: U_DDS_channel1 (IC13B.28 R12B.2), CLK_INPUT (C88.1)
DDS_CLK_N: U_DDS_channel2 (IC13C.28 R12C.2), CLK_INPUT (C60.1)
DDS_CLK_N: U_DDS_channel3 (IC13D.28 R12D.2), CLK_INPUT (C58.1)
DDS_CLK_P: U_DDS_channel0 (IC13A.27 R12A.1), CLK_INPUT (C92.1)
DDS_CLK_P: U_DDS_channel1 (IC13B.27 R12B.1), CLK_INPUT (C62.1)
DDS_CLK_P: U_DDS_channel2 (IC13C.27 R12C.1), CLK_INPUT (C59.1)
DDS_CLK_P: U_DDS_channel3 (IC13D.27 R12D.1), CLK_INPUT (C57.1)
DDS_CLKB0_N: U_DDS_channel0 (IC2A.91 R10A.2), CLK_INPUT (C66.1)
DDS_CLKB0_P: U_DDS_channel0 (IC2A.90 R10A.1), CLK_INPUT (C65.1)
DDS_CLKB1_N: U_DDS_channel1 (IC2B.91 R10B.2), CLK_INPUT (C61.1)
DDS_CLKB1_P: U_DDS_channel1 (IC2B.90 R10B.1), CLK_INPUT (C56.1)
DDS_CLKB2_N: U_DDS_channel2 (IC2C.91 R10C.2), CLK_INPUT (C71.1)
DDS_CLKB2_P: U_DDS_channel2 (IC2C.90 R10C.1), CLK_INPUT (C68.1)
DDS_CLKB3_N: U_DDS_channel3 (IC2D.91 R10D.2), CLK_INPUT (C96.1)
DDS_CLKB3_P: U_DDS_channel3 (IC2D.90 R10D.1), CLK_INPUT (C95.1)
DDS_I/O_RESET: U_DDS_channel0 (IC2A.71), U_DDS_channel1 (IC2B.71), U_DDS_channel2 (IC2C.71), U_DDS_channel3 (IC2D.71), CTRL_LOGIC (IC10.B9)
DDS_PLL_LOCK0: U_DDS_channel0 (IC2A.19), CTRL_LOGIC (IC10.E4)
DDS_PLL_LOCK1: U_DDS_channel1 (IC2B.19), CTRL_LOGIC (IC10.K2)
DDS_PLL_LOCK2: U_DDS_channel2 (IC2C.19), CTRL_LOGIC (IC10.N7)
DDS_PLL_LOCK3: U_DDS_channel3 (IC2D.19), CTRL_LOGIC (IC10.P7)
DDS_Profile0.P0: U_DDS_channel0 (IC2A.54), CTRL_LOGIC (IC10.A9)
DDS_Profile0.P1: U_DDS_channel0 (IC2A.53), CTRL_LOGIC (IC10.B8)
DDS_Profile0.P2: U_DDS_channel0 (IC2A.52), CTRL_LOGIC (IC10.A8)
DDS_Profile1.P0: U_DDS_channel1 (IC2B.54), CTRL_LOGIC (IC10.D3)
DDS_Profile1.P1: U_DDS_channel1 (IC2B.53), CTRL_LOGIC (IC10.D2)
DDS_Profile1.P2: U_DDS_channel1 (IC2B.52), CTRL_LOGIC (IC10.E2)
DDS_Profile2.P0: U_DDS_channel2 (IC2C.54), CTRL_LOGIC (IC10.M1)
DDS_Profile2.P1: U_DDS_channel2 (IC2C.53), CTRL_LOGIC (IC10.M6)
DDS_Profile2.P2: U_DDS_channel2 (IC2C.52), CTRL_LOGIC (IC10.M5)
DDS_Profile3.P0: U_DDS_channel3 (IC2D.54), CTRL_LOGIC (IC10.N3)
DDS_Profile3.P1: U_DDS_channel3 (IC2D.53), CTRL_LOGIC (IC10.P1)
DDS_Profile3.P2: U_DDS_channel3 (IC2D.52), CTRL_LOGIC (IC10.P2)
DDS_RESET0: U_DDS_channel0 (IC13A.59), CTRL_LOGIC (R142.1)
DDS_RESET1: U_DDS_channel1 (IC13B.59), CTRL_LOGIC (R144.1)
DDS_RESET2: U_DDS_channel2 (IC13C.59), CTRL_LOGIC (R145.1)
DDS_RESET3: U_DDS_channel3 (IC13D.59), CTRL_LOGIC (R146.1)
DDS_SCKI0: U_DDS_channel0 (IC2A.69 IC13A.64 R40A.2), CTRL_LOGIC (IC10.A2)
DDS_SCKI1: U_DDS_channel1 (IC2B.69 IC13B.64 R40B.2), CTRL_LOGIC (IC10.K3)
DDS_SCKI2: U_DDS_channel2 (IC2C.69 IC13C.64 R40C.2), CTRL_LOGIC (IC10.H4)
DDS_SCKI3: U_DDS_channel3 (IC2D.69 IC13D.64 R40D.2), CTRL_LOGIC (IC10.H2)
DDS_SDI0: U_DDS_channel0 (IC2A.67 IC13A.63 R41A.2), CTRL_LOGIC (IC10.B2)
DDS_SDI1: U_DDS_channel1 (IC2B.67 IC13B.63 R41B.2), CTRL_LOGIC (IC10.K5)
DDS_SDI2: U_DDS_channel2 (IC2C.67 IC13C.63 R41C.2), CTRL_LOGIC (IC10.H3)
DDS_SDI3: U_DDS_channel3 (IC2D.67 IC13D.63 R41D.2), CTRL_LOGIC (IC10.F5)
DDS_SDO0: U_DDS_channel0 (IC2A.68 IC13A.62), CTRL_LOGIC (IC10.A3)
DDS_SDO1: U_DDS_channel1 (IC2B.68 IC13B.62), CTRL_LOGIC (IC10.J3)
DDS_SDO2: U_DDS_channel2 (IC2C.68 IC13C.62), CTRL_LOGIC (IC10.J2)
DDS_SDO3: U_DDS_channel3 (IC2D.68 IC13D.62), CTRL_LOGIC (IC10.G3)
DDS_SYNC_CLK0: Urukul (R31.2), U_DDS_channel0 (IC2A.55), CTRL_LOGIC (IC10.P5)
DDS_SYNC_CLK_OUTEN: Urukul (IC4.3), CTRL_LOGIC (IC10.T5)
DDS_SYNC_CLKSEL: Urukul (R152.1), CTRL_LOGIC (IC10.T10)
DDS_SYNC_OUTEN: Urukul (IC16.3 R153.1), CTRL_LOGIC (IC10.R6)
DDS_UPDATE0: U_DDS_channel0 (IC2A.59 IC13A.60), CTRL_LOGIC (IC10.B1)
DDS_UPDATE1: U_DDS_channel1 (IC2B.59 IC13B.60), CTRL_LOGIC (IC10.P4)
DDS_UPDATE2: U_DDS_channel2 (IC2C.59 IC13C.60), CTRL_LOGIC (IC10.H5)
DDS_UPDATE3: U_DDS_channel3 (IC2D.59 IC13D.60), CTRL_LOGIC (IC10.E3)
DRCTL0: U_DDS_channel0 (IC2A.62), CTRL_LOGIC (IC10.C14)
DRCTL1: U_DDS_channel1 (IC2B.62), CTRL_LOGIC (IC10.C4)
DRCTL2: U_DDS_channel2 (IC2C.62), CTRL_LOGIC (IC10.K1)
DRCTL3: U_DDS_channel3 (IC2D.62), CTRL_LOGIC (IC10.N1)
DRHOLD0: U_DDS_channel0 (IC2A.63), CTRL_LOGIC (IC10.E13)
DRHOLD1: U_DDS_channel1 (IC2B.63), CTRL_LOGIC (IC10.C7)
DRHOLD2: U_DDS_channel2 (IC2C.63), CTRL_LOGIC (IC10.L4)
DRHOLD3: U_DDS_channel3 (IC2D.63), CTRL_LOGIC (IC10.N4)
DROVER0: U_DDS_channel0 (IC2A.61), CTRL_LOGIC (IC10.D11)
DROVER1: U_DDS_channel1 (IC2B.61), CTRL_LOGIC (IC10.B4)
DROVER2: U_DDS_channel2 (IC2C.61), CTRL_LOGIC (IC10.L2)
DROVER3: U_DDS_channel3 (IC2D.61), CTRL_LOGIC (IC10.N5)
EEM0_0: U_LVDS_IFCA (IC1A.35 IC1A.36), CTRL_LOGIC (IC10.M2)
EEM0_1: U_LVDS_IFCA (IC1A.32 IC1A.33), CTRL_LOGIC (IC10.R13)
EEM0_2: U_LVDS_IFCA (IC1A.28 IC1A.29), CTRL_LOGIC (IC10.T16)
EEM0_3: U_LVDS_IFCA (IC1A.25 IC1A.26), CTRL_LOGIC (IC10.R16)
EEM0_4: U_LVDS_IFCA (IC6A.35 IC6A.36), CTRL_LOGIC (IC10.R15)
EEM0_5: U_LVDS_IFCA (IC6A.32 IC6A.33), CTRL_LOGIC (IC10.R14)
EEM0_6: U_LVDS_IFCA (IC6A.28 IC6A.29), CTRL_LOGIC (IC10.R12)
EEM0_7: U_LVDS_IFCA (IC6A.25 IC6A.26), CTRL_LOGIC (IC10.T15)
EEM1_0: U_LVDS_IFCB (IC1B.35 IC1B.36), CTRL_LOGIC (IC10.M3)
EEM1_1: U_LVDS_IFCB (IC1B.32 IC1B.33), CTRL_LOGIC (IC10.J5)
EEM1_2: U_LVDS_IFCB (IC1B.28 IC1B.29), CTRL_LOGIC (IC10.R3)
EEM1_3: U_LVDS_IFCB (IC1B.25 IC1B.26), CTRL_LOGIC (IC10.R2)
EEM1_4: U_LVDS_IFCB (IC6B.35 IC6B.36), CTRL_LOGIC (IC10.R1)
EEM1_5: U_LVDS_IFCB (IC6B.32 IC6B.33), CTRL_LOGIC (IC10.T1)
EEM1_6: U_LVDS_IFCB (IC6B.28 IC6B.29), CTRL_LOGIC (IC10.T2)
EEM1_7: U_LVDS_IFCB (IC6B.25 IC6B.26), CTRL_LOGIC (IC10.T3)
FSEN_EM0: U_LVDS_IFCA (8 pins), CTRL_LOGIC (IC10.N15 R175.2)
FSEN_EM1: U_LVDS_IFCB (8 pins), CTRL_LOGIC (IC10.N14 R1.2)
I2C_SCL: U_LVDS_IFCA (D1A.3 IC8A.1 IC26A.6 J1A.27), Supply_DDS (R125.1)
I2C_SDA: U_LVDS_IFCA (D1A.2 IC8A.3 IC26A.5 J1A.26), Supply_DDS (R124.1)
IN_SEL: CTRL_LOGIC (IC10.G5), CLK_INPUT (R154.1)
INT_CLK_IN: Urukul (J7.1), CLK_INPUT (C190.1)
LED0: Urukul (R27.1), CTRL_LOGIC (IC10.E11)
LED1: Urukul (R28.1), CTRL_LOGIC (IC10.B10)
LED2: Urukul (R29.1), CTRL_LOGIC (IC10.A13)
LED3: Urukul (R30.1), CTRL_LOGIC (IC10.A11)
LED4: Urukul (R43.1), CTRL_LOGIC (IC10.A14)
LED5: Urukul (R44.1), CTRL_LOGIC (IC10.B14)
LED6: Urukul (R25.1), CTRL_LOGIC (IC10.A12)
LED7: Urukul (R26.1), CTRL_LOGIC (IC10.B11)
LVDS0_N: Urukul (IC4.5), U_LVDS_IFCB (IC1B.48 J1B.3 R7B.2)
LVDS0_P: Urukul (IC4.6), U_LVDS_IFCB (IC1B.47 J1B.2 R7B.1)
LVDS1_N: Urukul (IC16.5), U_LVDS_IFCB (IC1B.4 J1B.6 R9B.2)
LVDS1_P: Urukul (IC16.6), U_LVDS_IFCB (IC1B.3 J1B.5 R9B.1)
LVDS7_N: Urukul (IC9.11), U_LVDS_IFCA (IC6A.14 J1A.24 R35A.2)
LVDS7_P: Urukul (IC9.10), U_LVDS_IFCA (IC6A.13 J1A.23 R35A.1)
Master_RESET: U_DDS_channel0 (IC2A.14), U_DDS_channel1 (IC2B.14), U_DDS_channel2 (IC2C.14), U_DDS_channel3 (IC2D.14), CTRL_LOGIC (IC10.F16)
MMCX_OSCn_SEL: CTRL_LOGIC (IC10.C11), CLK_INPUT (R165.1)
OSC_ENn: CTRL_LOGIC (IC10.B6), CLK_INPUT (T1.1)
OSK0: U_DDS_channel0 (IC2A.60), CTRL_LOGIC (IC10.C13)
OSK1: U_DDS_channel1 (IC2B.60), CTRL_LOGIC (IC10.C3)
OSK2: U_DDS_channel2 (IC2C.60), CTRL_LOGIC (IC10.L1)
OSK3: U_DDS_channel3 (IC2D.60), CTRL_LOGIC (IC10.N2)
~{RE}_DE0: U_LVDS_IFCA (IC1A.1 IC1A.40), CTRL_LOGIC (IC10.P15)
~{RE}_DE1: U_LVDS_IFCA (IC1A.5 IC1A.42), CTRL_LOGIC (IC10.M15)
~{RE}_DE2: U_LVDS_IFCA (IC1A.8 IC1A.19), CTRL_LOGIC (IC10.K15)
~{RE}_DE3: U_LVDS_IFCA (IC1A.12 IC1A.21), CTRL_LOGIC (IC10.N16)
~{RE}_DE4: U_LVDS_IFCA (IC6A.1 IC6A.40), CTRL_LOGIC (IC10.L15)
~{RE}_DE5: U_LVDS_IFCA (IC6A.5 IC6A.42), CTRL_LOGIC (IC10.M16)
~{RE}_DE6: U_LVDS_IFCA (IC6A.8 IC6A.19), CTRL_LOGIC (IC10.L16)
~{RE}_DE7: U_LVDS_IFCA (IC6A.12 IC6A.21), CTRL_LOGIC (IC10.P16)
~{RE}_DE8: U_LVDS_IFCB (IC1B.1 IC1B.40), CTRL_LOGIC (IC10.R7)
~{RE}_DE9: U_LVDS_IFCB (IC1B.5 IC1B.42), CTRL_LOGIC (IC10.T4)
~{RE}_DE10: U_LVDS_IFCB (IC1B.8 IC1B.19), CTRL_LOGIC (IC10.R4)
~{RE}_DE11: U_LVDS_IFCB (IC1B.12 IC1B.21), CTRL_LOGIC (IC10.R5)
~{RE}_DE12: U_LVDS_IFCB (IC6B.1 IC6B.40), CTRL_LOGIC (IC10.M7)
~{RE}_DE13: U_LVDS_IFCB (IC6B.5 IC6B.42), CTRL_LOGIC (IC10.R8)
~{RE}_DE14: U_LVDS_IFCB (IC6B.8 IC6B.19), CTRL_LOGIC (IC10.T7)
~{RE}_DE15: U_LVDS_IFCB (IC6B.12 IC6B.21), CTRL_LOGIC (IC10.M8)
RF_OUT0: Urukul (R180.2 TR5.3), U_DDS_OUT_channel0 (C50A.2 D2A.2 R192A.2)
RF_OUT1: Urukul (R179.2 TR4.3), U_DDS_OUT_channel1 (C50B.2 D2B.2 R192B.2)
RF_OUT2: Urukul (R181.2 TR6.3), U_DDS_OUT_channel2 (C50C.2 D2C.2 R192C.2)
RF_OUT3: Urukul (R182.2 TR7.3), U_DDS_OUT_channel3 (C50D.2 D2D.2 R192D.2)
RFSW_CTRL0: U_DDS_OUT_channel0 (IC23A.2 R20A.2), CTRL_LOGIC (IC10.D13)
RFSW_CTRL1: U_DDS_OUT_channel1 (IC23B.2 R20B.2), CTRL_LOGIC (IC10.C12)
RFSW_CTRL2: U_DDS_OUT_channel2 (IC23C.2 R20C.2), CTRL_LOGIC (IC10.D10)
RFSW_CTRL3: U_DDS_OUT_channel3 (IC23D.2 R20D.2), CTRL_LOGIC (IC10.D9)
SYNC_SMP_ERR0: U_DDS_channel0 (IC2A.12), CTRL_LOGIC (IC10.D4)
SYNC_SMP_ERR1: U_DDS_channel1 (IC2B.12), CTRL_LOGIC (IC10.J1)
SYNC_SMP_ERR2: U_DDS_channel2 (IC2C.12), CTRL_LOGIC (IC10.P6)
SYNC_SMP_ERR3: U_DDS_channel3 (IC2D.12), CTRL_LOGIC (IC10.N6)

## Assembly variants
AD9912: not fitted C1 C13 C43A C43B C43C C43D C44A C44B C44C C44D C45 C46 C50A C50B C50C C50D C51A C51B C51C C51D C52A C52B C52C C52D C53A C53B C53C C53D C56 C61 C65 C66 C68 C69 C71 C72A C72B C72C C72D C80 C82A C82B C82C C82D C83A C83B C83C C83D C85A C85B C85C C85D C86 C89 C90 C95 C96 C99A C99B C99C C99D C105A C105B C105C C105D C106A C106B C106C C106D C108A C108B C108C C108D C109A C109B C109C C109D C110A C110B C110C C110D C111A C111B C111C C111D C112A C112B C112C C112D C113 C116A C116B C116C C116D C117A C117B C117C C117D C118A C118B C118C C118D C119A C119B C119C C119D C120A C120B C120C C120D C121 C124A C124B C124C C124D C139 C157A C157B C157C C157D C158A C158B C158C C158D C159A C159B C159C C159D C164A C164B C164C C164D C172A C172B C172C C172D C176A C176B C176C C176D C180A C180B C180C C180D C191 C195 C202A C202B C202C C202D C203A C203B C203C C203D C204A C204B C204C C204D C205A C205B C205C C205D C206A C206B C206C C206D C207A C207B C207C C207D C213 C214 CLIP1 CLIP2 CLIP3 CLIP4 CLIP5 CLIP6 CLIP7 CLIP8 CLIP9 CLIP10 CLIP11 CLIP12 CLIP13 CLIP14 CLIP15 CLIP16 CLIP17 CLIP18 CLIP19 CLIP20 CLIP21 CLIP22 CLIP23 CLIP24 CLIP25 CLIP26 CLIP27 CLIP28 CLIP29 CLIP30 CLIP31 FTG1 FTG2 FTG3 FTG4 IC2A IC2B IC2C IC2D IC4 IC9 IC16 IC22 IC25 IC26A IC26B J9 J10 L8 L13 OSC2 R3A R3B R3C R3D R4A R4B R4C R4D R10A R10B R10C R10D R22 R31 R32 R34 R36 R37 R38A R38B R38C R38D R39 R42 R54A R54B R54C R54D R56A R56B R56C R56D R60 R61 R62 R63 R68 R69 R70 R71 R72 R76 R77 R78A R78B R78C R78D R88A R88B R88C R88D R90A R90B R90C R90D R92A R92B R92C R92D R95 R101 R102 R108 R109 R112A R112B R112C R112D R114 R134 R136 R148 R166 R167 R168 R178A R178B R178C R178D R190 R191 R193 TR2 TR3 TR4 TR5 TR6 TR7 TR8A TR8B TR8C TR8D
AD9910: not fitted C30A C30B C30C C30D C44A C44B C44C C44D C50A C50B C50C C50D C57 C58 C59 C60 C62 C69 C80 C88 C92 C93 C107A C107B C107C C107D C113 C121 C127A C127B C127C C127D C128A C128B C128C C128D C133A C133B C133C C133D C134A C134B C134C C134D C135A C135B C135C C135D C136A C136B C136C C136D C137A C137B C137C C137D C138A C138B C138C C138D C139 C140A C140B C140C C140D C141A C141B C141C C141D C142A C142B C142C C142D C143A C143B C143C C143D C144A C144B C144C C144D C146A C146B C146C C146D C147A C147B C147C C147D C148A C148B C148C C148D C149A C149B C149C C149D C150A C150B C150C C150D C164A C164B C164C C164D C172A C172B C172C C172D C176A C176B C176C C176D C180A C180B C180C C180D C191 C195 C202A C202B C202C C202D C203A C203B C203C C203D C204A C204B C204C C204D C205A C205B C205C C205D C206A C206B C206C C206D C207A C207B C207C C207D C213 C214 CLIP1 CLIP2 CLIP3 CLIP4 CLIP5 CLIP6 CLIP7 CLIP8 CLIP9 CLIP10 CLIP11 CLIP12 CLIP13 CLIP14 CLIP15 CLIP16 CLIP17 CLIP18 CLIP19 CLIP20 CLIP21 CLIP22 CLIP23 CLIP24 CLIP25 CLIP26 CLIP27 CLIP28 CLIP29 CLIP30 CLIP31 FTG1 FTG2 FTG3 FTG4 IC13A IC13B IC13C IC13D IC22 IC25 IC26A IC26B J9 J10 L17A L17B L17C L17D L20A L20B L20C L20D L21A L21B L21C L21D OSC2 R3A R3B R3C R3D R4A R4B R4C R4D R8A R8B R8C R8D R12A R12B R12C R12D R15A R15B R15C R15D R22 R34 R37 R42 R48A R48B R48C R48D R49A R49B R49C R49D R50A R50B R50C R50D R51A R51B R51C R51D R60 R61 R62 R63 R69 R70 R71 R72 R76 R77 R79A R79B R79C R79D R89A R89B R89C R89D R91A R91B R91C R91D R93A R93B R93C R93D R94A R94B R94C R94D R95 R96A R96B R96C R96D R97A R97B R97C R97D R98A R98B R98C R98D R99A R99B R99C R99D R101 R102 R103 R104A R104B R104C R104D R105A R105B R105C R105D R106A R106B R106C R106D R107A R107B R107C R107D R110 R113A R113B R113C R113D R134 R136 R140A R140B R140C R140D R166 R167 R168 R178A R178B R178C R178D R190 R191 R193 TR2 TR3 TR4 TR5 TR6 TR7 TR8A TR8B TR8C TR8D